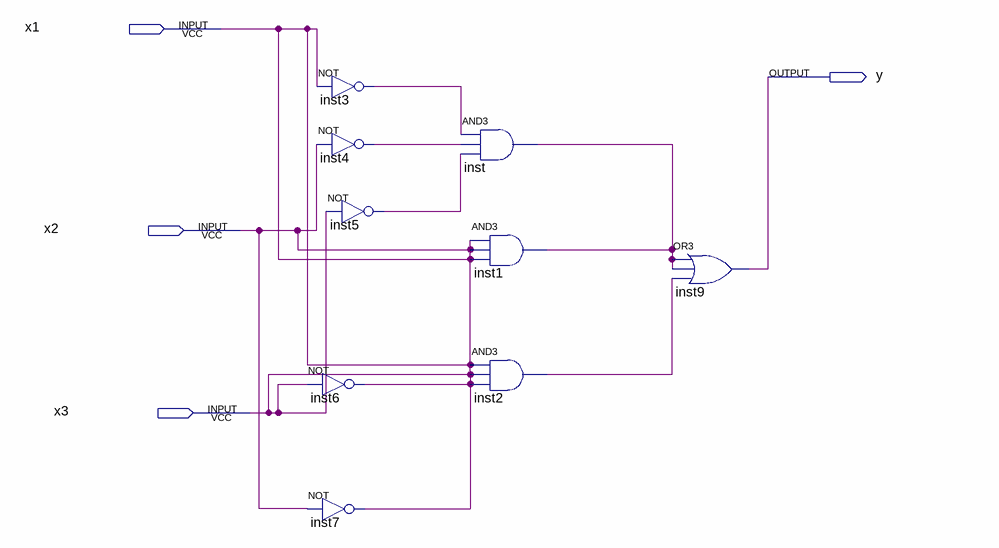
[diagram p0: schematic sheet]
// Quartus schematic testing_one.bdf as structural Verilog: 9 symbols, 4 pins
module testing_one (
  input  x1,
  input  x2,
  input  x3,
  output y
);

  wire inst2_out, inst3_out, inst4_out, inst5_out, inst_out;

  not inst3 (inst3_out, x1);
  not inst4 (inst4_out, x1);
  not inst6 (x1, x1);
  not inst7 (x1, x1);
  not inst5 (inst5_out, x1);
  and inst (inst_out, inst3_out, inst4_out, inst5_out);
  and inst1 (inst_out, x1, x1, x1);
  and inst2 (inst2_out, x1, x1, x1);
  or inst9 (y, inst_out, inst_out, inst2_out);

  assign x2 = x1;
  assign x3 = x1;
endmodule
